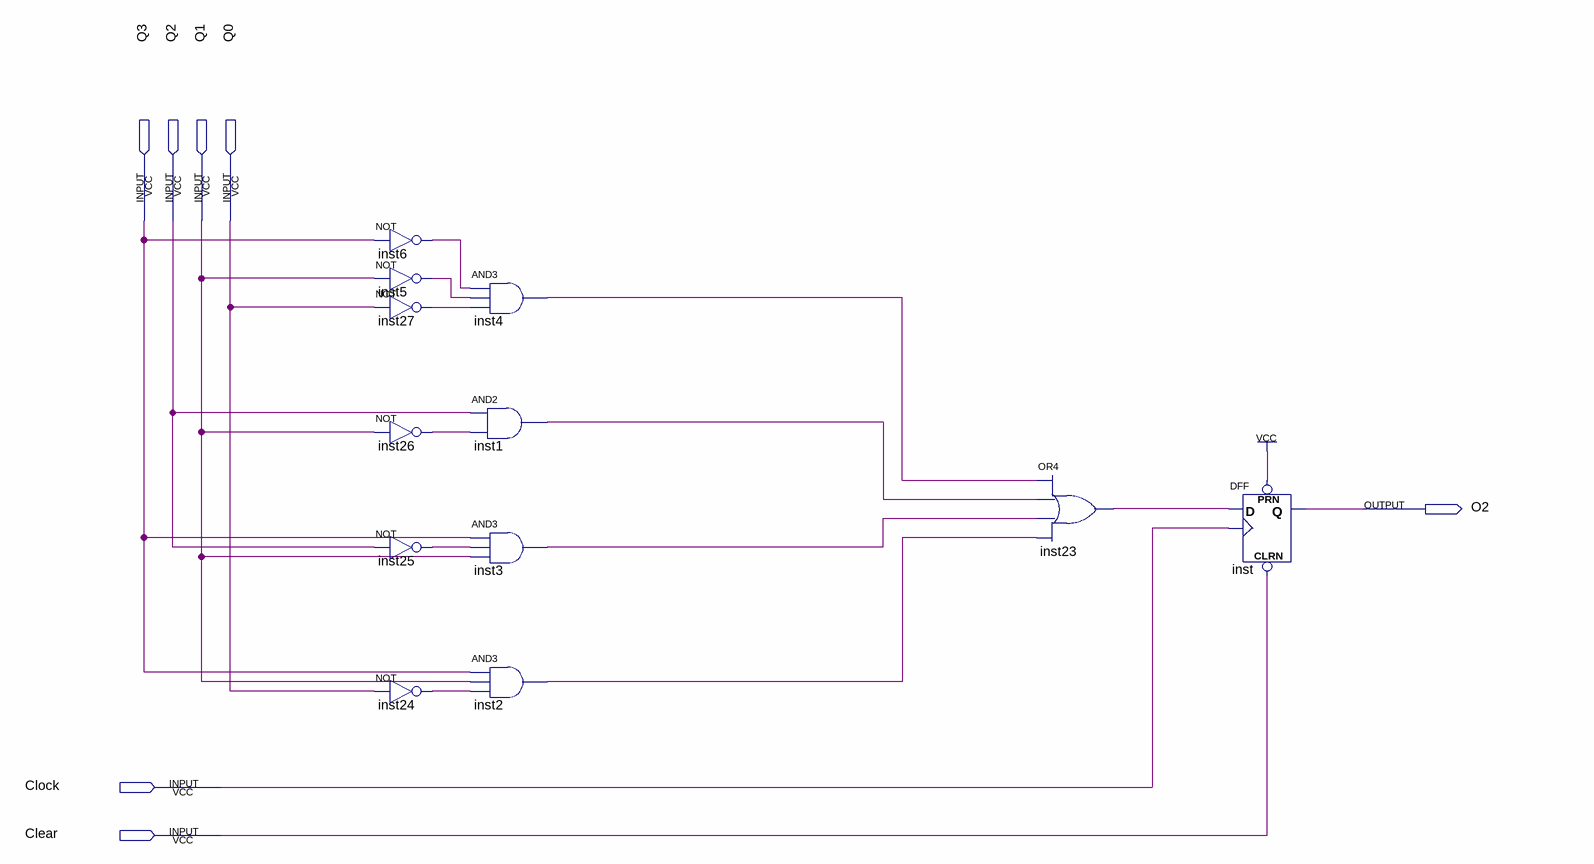
[diagram p0: schematic sheet]
// Quartus schematic D2.bdf as structural Verilog: 12 symbols, 7 pins
module D2 (
  input  Q3,
  input  Q2,
  input  Q1,
  input  Q0,
  input  Clock,
  input  Clear,
  output O2
);

  wire inst1_out, inst2_out, inst3_out, inst4_out, inst5_out, inst6_out, inst23_out, inst24_out, inst25_out,
       inst26_out, inst27_out;

  not inst6 (inst6_out, Q3);
  not inst5 (inst5_out, Q1);
  not inst27 (inst27_out, Q0);
  not inst26 (inst26_out, Q1);
  not inst25 (inst25_out, Q2);
  not inst24 (inst24_out, Q0);
  and inst4 (inst4_out, inst6_out, inst5_out, inst27_out);
  and inst1 (inst1_out, Q2, inst26_out);
  and inst3 (inst3_out, Q3, inst25_out, Q1);
  and inst2 (inst2_out, Q3, Q1, inst24_out);
  or inst23 (inst23_out, inst4_out, inst1_out, inst3_out, inst2_out);
  DFF inst (.CLRN(Clear), .CLK(Clock), .D(inst23_out), .PRN(1'b1), .Q(O2));
endmodule
